# EAGLE design A604X (EAGLE 6.6.0)
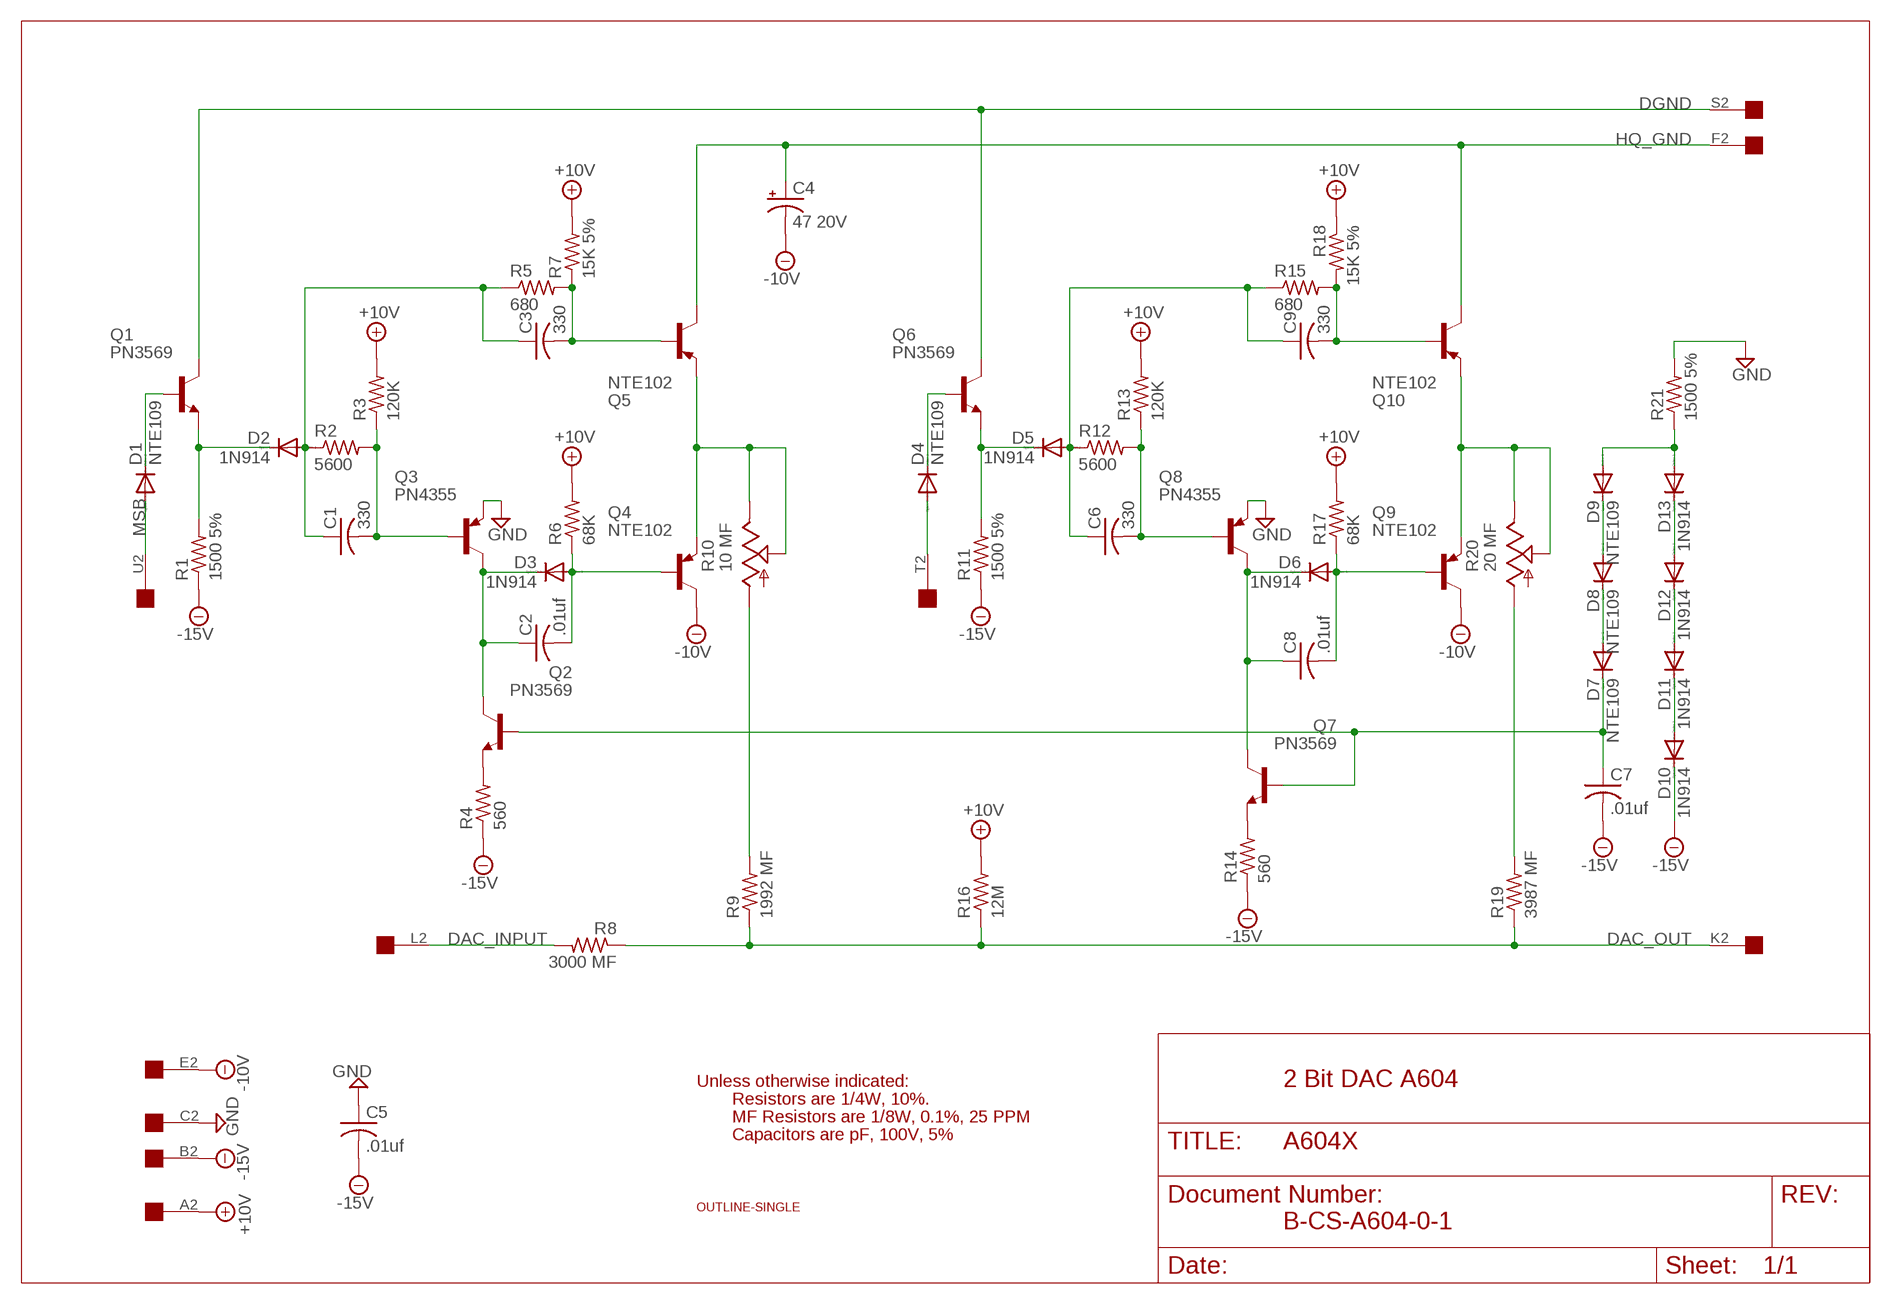
[diagram p0: schematic, sheet 1]

## Parts
C1  330  C-US075-032X103  [C075-032X103]
C2  .01uf  C-US050-025X075  [C050-025X075]
C3  330  C-US075-032X103  [C075-032X103]
C4  47 20V  CPOL-USE22-6AXIAL  [E22-6]
C5  .01uf  C-US050-025X075  [C050-025X075]
C6  330  C-US075-032X103  [C075-032X103]
C7  .01uf  C-US050-025X075  [C050-025X075]
C8  .01uf  C-US050-025X075  [C050-025X075]
C9  330  C-US075-032X103  [C075-032X103]
D1  NTE109  1N4148DO35-10  [DO35-10]
D2  1N914  1N4148DO35-10  [DO35-10]
D3  1N914  1N4148DO35-10  [DO35-10]
D4  NTE109  1N4148DO35-10  [DO35-10]
D5  1N914  1N4148DO35-10  [DO35-10]
D6  1N914  1N4148DO35-10  [DO35-10]
D7  NTE109  1N4148DO35-10  [DO35-10]
D8  NTE109  1N4148DO35-10  [DO35-10]
D9  NTE109  1N4148DO35-10  [DO35-10]
D10  1N914  1N4148DO35-10  [DO35-10]
D11  1N914  1N4148DO35-10  [DO35-10]
D12  1N914  1N4148DO35-10  [DO35-10]
D13  1N914  1N4148DO35-10  [DO35-10]
Q1  PN3569  2N1613-NPN-TO39-EBC  [TO39]
Q2  PN3569  2N1613-NPN-TO39-EBC  [TO39]
Q3  PN4355  2N2904A  [TO39]
Q4  NTE102  2N2904A  [TO39]
Q5  NTE102  2N2904A  [TO39]
Q6  PN3569  2N1613-NPN-TO39-EBC  [TO39]
Q7  PN3569  2N1613-NPN-TO39-EBC  [TO39]
Q8  PN4355  2N2904A  [TO39]
Q9  NTE102  2N2904A  [TO39]
Q10  NTE102  2N2904A  [TO39]
R1  1500 5%  R-US_0207/10  [0207/10]
R2  5600  R-US_0207/10  [0207/10]
R3  120K  R-US_0207/10  [0207/10]
R4  560  R-US_0207/10  [0207/10]
R5  680  R-US_0207/10  [0207/10]
R6  68K  R-US_0207/10  [0207/10]
R7  15K 5%  R-US_0207/10  [0207/10]
R8  3000 MF  R-US_0309/12  [0309/12]
R9  1992 MF  R-US_0309/12  [0309/12]
R10  10 MF  TRIM_US-S75P  [S75P]
R11  1500 5%  R-US_0207/10  [0207/10]
R12  5600  R-US_0207/10  [0207/10]
R13  120K  R-US_0207/10  [0207/10]
R14  560  R-US_0207/10  [0207/10]
R15  680  R-US_0207/10  [0207/10]
R16  12M  R-US_0207/10  [0207/10]
R17  68K  R-US_0207/10  [0207/10]
R18  15K 5%  R-US_0207/10  [0207/10]
R19  3987 MF  R-US_0309/12  [0309/12]
R20  20 MF  TRIM_US-S75P  [S75P]
R21  1500 5%  R-US_0207/10  [0207/10]
U$1  OUTLINE-SINGLE  [SINGLE]
U$3  EDGE-1  [EDGE-CON1]

## Nets
+10V [supply]: R3.2 R6.2 R7.2 R13.2 R16.2 R17.2 R18.1 U$3.A2
-10V [supply]: C4.- Q4.3(C) Q9.3(C) U$3.E2
-15V [supply]: C5.2 C7.2 D10.C R1.1 R4.1 R11.1 R14.1 U$3.B2
DAC_INPUT [supply]: R8.2 U$3.L2
DAC_OUT [supply]: R8.1 R9.1 R16.1 R19.1 U$3.K2
DGND: Q1.3(C) Q6.3(C) U$3.S2
GND [supply]: C5.1 Q3.1(E) Q8.1(E) R21.2 U$3.C2
HQ_GND [supply]: C4.+ Q5.3(C) Q10.3(C) U$3.F2
MSB: D1.A U$3.U2
N$1: D1.C Q1.2(B)
N$2: D2.C Q1.1(E) R1.2
N$3: C1.1 C3.1 D2.A R2.1 R5.1
N$4: C1.2 Q3.2(B) R2.2 R3.1
N$5: C3.2 Q5.2(B) R5.2 R7.1
N$6: C2.1 D3.C Q2.3(C) Q3.3(C)
N$7: C2.2 D3.A Q4.2(B) R6.1
N$8: Q4.1(E) Q5.1(E) R10.E R10.S
N$10: D4.C Q6.2(B)
N$11: D5.C Q6.1(E) R11.2
N$12: C6.1 C9.1 D5.A R12.1 R15.1
N$13: C6.2 Q8.2(B) R12.2 R13.1
N$14: C9.2 Q10.2(B) R15.2 R18.2
N$15: C8.1 D6.C Q7.3(C) Q8.3(C)
N$16: C8.2 D6.A Q9.2(B) R17.1
N$17: Q9.1(E) Q10.1(E) R20.E R20.S
N$18: Q2.1(E) R4.2
N$19: R9.2 R10.A
N$20: R19.2 R20.A
N$21: Q7.1(E) R14.2
N$22: C7.1 D7.C Q2.2(B) Q7.2(B)
N$23: D8.A D9.C
N$24: D7.A D8.C
N$25: D10.A D11.C
N$27: D12.A D13.C
N$28: D11.A D12.C
N$30: D9.A D13.A R21.1
T2: D4.A U$3.T2
Unconnected: U$3.D2 U$3.H2 U$3.J2 U$3.M2 U$3.N2 U$3.P2 U$3.R2 U$3.V2

## Notes on the sheet
- Unless otherwise indicated: | 2 Bit DAC A604
- Resistors are 1/4W, 10%.
- MF Resistors are 1/8W, 0.1%, 25 PPM
- Capacitors are pF, 100V, 5%
- B-CS-A604-0-1

## Library data of the parts
C1-C3 C5-C9 = rcl:C-US: CAPACITOR, American symbol
C4 = rcl:CPOL-US: POLARIZED CAPACITOR, American symbol
D1-D13 = diode:1N4148: DIODE high speed (Philips)
Q1 Q2 Q6 Q7 = transistor:*-NPN-: NPN Transistror BF959 corrected 2008.03.06
Q3-Q5 Q8-Q10 = transistor-pnp:2N2904*: PNP Transistror
R1-R9 R11-R19 R21 = rcl:R-US_: RESISTOR, American symbol
R10 R20 = pot:TRIM_US-: POTENTIOMETER
U$1 = dec-con:OUTLINE-*: Board outlines for DEC boards.
U$3 = dec-con:EDGE-1: Single-Sided DEC Edge Connector -- (side 2)

## Net classes
1 supply: width 0.813 mm

## Board
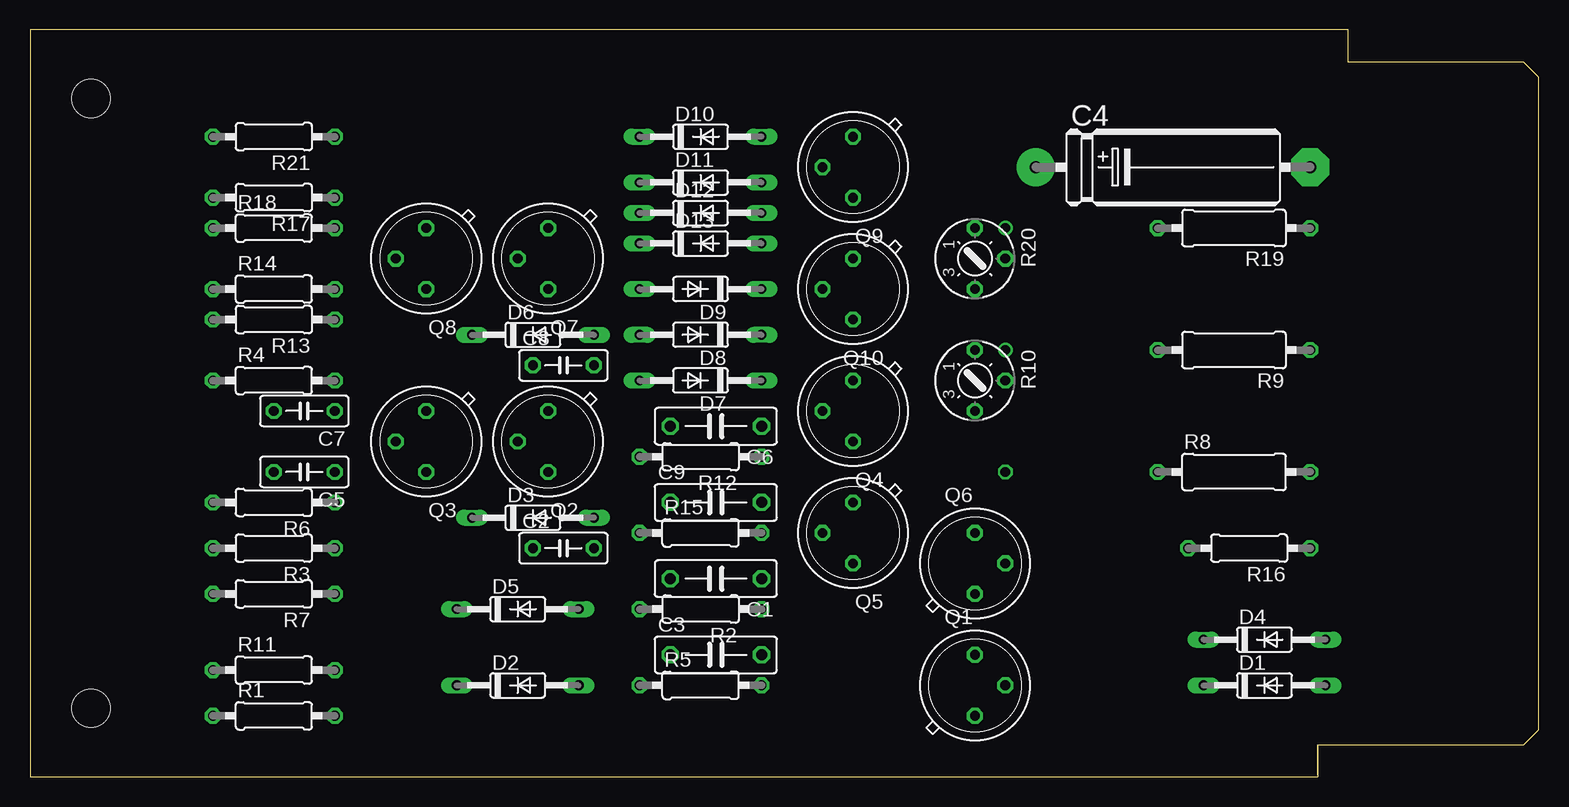
[diagram p1: board, top side]
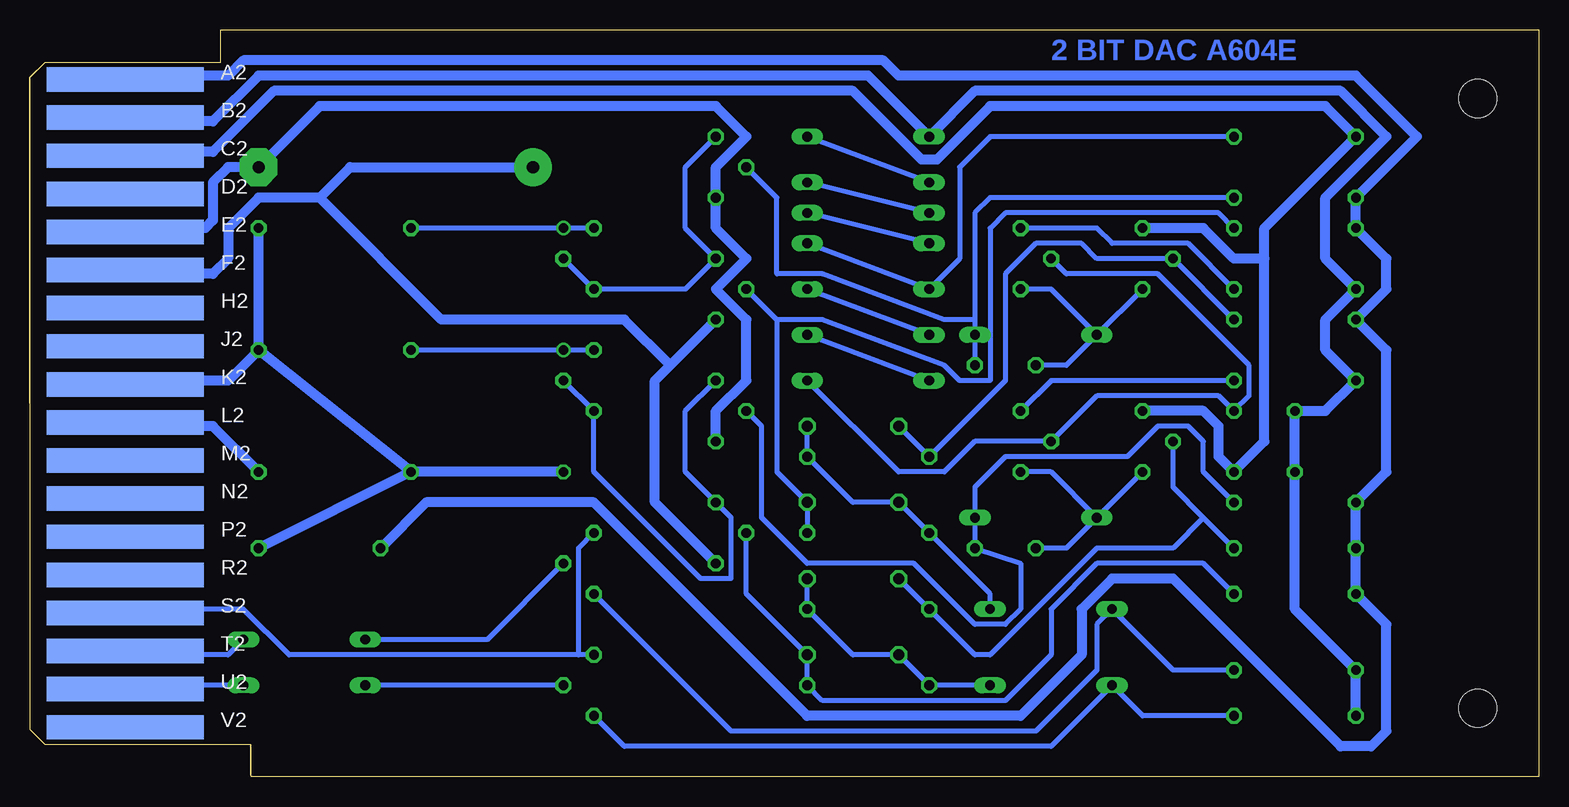
[diagram p2: board, bottom side, seen from below]

Size 125.73 x 62.23 mm. Coordinates in mm from the lower left corner, seen from the top.
Copper layers (1+16): Top 0.035mm / dielectric 1.5mm / Bottom 0.035mm
Design rules "16mils": minimum track width 16mil, minimum drill 32mil, track to track 15mil, track to pad 10mil, pad to pad 10mil, via to via 10mil, smd to smd 10mil, copper to edge 13mil, drill to drill 10mil, minimum pad ring 10mil, minimum via ring 8mil, stop-mask expansion 0mil, vias tented up to drill 0mil, thermal gap 10mil

### Footprints (pad centres in the part's own frame; a part is rotated, then mirrored left to right if it is on the bottom)
C075-032X103 = drill 0.914 octagon: 1 -3.81,0; 2 3.81,0
C050-025X075 = drill 0.813 octagon: 1 -2.54,0; 2 2.54,0
E22-6 = drill 1.016 pad 3.15: + -11.43,0 | drill 1.016 pad 3.15 octagon: - 11.43,0
DO35-10 = drill 0.813 long: A 5.08,0; C -5.08,0
TO39 = drill 0.813 octagon: 1 0,-2.54; 2 2.54,0; 3 0,2.54
0207/10 = drill 0.813 octagon: 1 -5.08,0; 2 5.08,0
0309/12 = drill 0.813 octagon: 1 -6.35,0; 2 6.35,0
S75P = drill 0.813 octagon: A -2.54,0; E 2.54,0; S 0,2.54
SINGLE = hole 3.175: 120.65,56.515; 120.65,5.715
EDGE-CON1 = smd 13.106 x 2.032 bottom: A2 7.938,4.128; B2 7.938,7.303; C2 7.938,10.477; D2 7.938,13.652; E2 7.938,16.828; F2 7.938,20.003; H2 7.938,23.177; J2 7.938,26.352; K2 7.938,29.527; L2 7.938,32.703; M2 7.938,35.877; N2 7.938,39.053; P2 7.938,42.227; R2 7.938,45.403; S2 7.938,48.578; T2 7.938,51.752; U2 7.938,54.928; V2 7.938,58.102

### Placement (x,y rotation side)
C1  57.15,16.51 180 top
C2  44.45,19.05 0 top
C3  57.15,10.16 0 top
C4  95.25,50.8 0 top
C5  22.86,25.4 180 top
C6  57.15,29.21 180 top
C7  22.86,30.48 180 top
C8  44.45,34.29 0 top
C9  57.15,22.86 0 top
D1  102.87,7.62 0 top
D2  40.64,7.62 0 top
D3  41.91,21.59 0 top
D4  102.87,11.43 0 top
D5  40.64,13.97 0 top
D6  41.91,36.83 0 top
D7  55.88,33.02 180 top
D8  55.88,36.83 180 top
D9  55.88,40.64 180 top
D10  55.88,53.34 0 top
D11  55.88,49.53 0 top
D12  55.88,46.99 0 top
D13  55.88,44.45 0 top
Q1  78.74,7.62 0 top
Q2  43.18,27.94 180 top
Q3  33.02,27.94 180 top
Q4  68.58,30.48 180 top
Q5  68.58,20.32 180 top
Q6  78.74,17.78 0 top
Q7  43.18,43.18 180 top
Q8  33.02,43.18 180 top
Q9  68.58,50.8 180 top
Q10  68.58,40.64 180 top
R1  20.32,5.08 0 top
R2  55.88,13.97 180 top
R3  20.32,19.05 180 top
R4  20.32,33.02 0 top
R5  55.88,7.62 0 top
R6  20.32,22.86 180 top
R7  20.32,15.24 180 top
R8  100.33,25.4 0 top
R9  100.33,35.56 180 top
R10  78.74,33.02 270 top
R11  20.32,8.89 0 top
R12  55.88,26.67 180 top
R13  20.32,38.1 180 top
R14  20.32,40.64 0 top
R15  55.88,20.32 0 top
R16  101.6,19.05 180 top
R17  20.32,48.26 180 top
R18  20.32,45.72 0 top
R19  100.33,45.72 180 top
R20  78.74,43.18 270 top
R21  20.32,53.34 180 top
U$1  125.73,62.23 180 top
U$3  125.73,62.23 180 top

### Tracks (layer width: path | path; a pad name or v marks a point on that pad's centre or on a via)
+10V
  Bottom 0.813: U$3.A2 117.22,58.04 116.84,58.42 109.22,58.42 107.95,59.69 54.61,59.69 53.34,58.42 15.24,58.42 10.16,53.34 R17.2 R18.1 12.7,43.18 12.7,40.64 R13.2 12.7,35.56 12.7,25.4 R6.2 R3.2 R7.2 12.7,12.7 12.7,3.81 13.97,2.54 16.51,2.54 30.48,16.51 35.56,16.51 38.1,13.97 38.1,10.16 43.18,5.08 60.96,5.08 78.74,22.86 92.71,22.86 R16.2
-10V
  Bottom 0.813: U$3.E2 117.17,45.39 116.84,45.72 111.12,45.72 110.49,46.35 110.49,49.53 109.22,50.8 C4.- 101.6,55.88 68.58,55.88 66.04,53.34 68.58,50.8 Q9.3 68.58,45.72 66.04,43.18 68.58,40.64 66.04,38.1 66.04,33.02 68.58,30.48 Q4.3
-15V
  Bottom 0.813: R1.1 R11.1 20.32,13.97 C5.2 C7.2 17.78,30.48 R4.1 17.78,35.56 17.78,38.1 R14.1 17.78,43.18 17.78,48.26 12.7,53.34 16.51,57.15 46.99,57.15 D10.C 55.88,58.42 106.68,58.42 110.49,54.61 116.84,54.61 117.13,54.9 U$3.B2
DAC_INPUT
  Bottom 0.813: U$3.L2 117.17,29.54 116.84,29.21 110.49,29.21 R8.2
DAC_OUT  (via drill 0.81)
  Bottom 0.813: U$3.K2 117.14,32.72 116.84,33.02 109.22,33.02 R9.1 | R9.1 R19.1 | R8.1 R16.1 | R8.1 R9.1 | v81.28,25.4 R8.1
DGND
  Bottom 0.406: Q1.3 80.01,10.16 | 80.01,10.16 104.14,10.16 107.95,13.97 115.57,13.97 115.88,13.66 U$3.S2 | Q6.3 80.01,19.05 80.01,10.16
GND
  Bottom 0.813: U$3.C2 117.17,51.74 116.84,52.07 110.49,52.07 105.41,57.15 57.15,57.15 51.44,51.44 50.16,51.44 45.72,55.88 17.78,55.88 R21.2 22.86,45.72 22.86,43.18 | 22.86,43.18 22.86,27.94 C5.1 26.67,26.67 26.67,29.21 27.94,30.48 Q3.1 | Q8.1 27.94,45.72 25.4,43.18 22.86,43.18
HQ_GND
  Bottom 0.813: Q5.3 73.66,22.86 73.66,33.02 72.39,34.29 | 72.39,34.29 Q10.3 | U$3.F2 117.12,42.19 116.84,41.91 110.49,41.91 109.22,43.18 109.22,45.72 106.68,48.26 101.6,48.26 | C4.+ 99.06,50.8 101.6,48.26 | 72.39,34.29 76.2,38.1 91.44,38.1 101.6,48.26
MSB
  Bottom 0.406: U$3.U2 117.2,7.26 116.84,7.62 D1.A
N$1
  Bottom 0.406: Q1.2 D1.C
N$2
  Bottom 0.406: R1.2 33.02,5.08 D2.C 40.64,2.54 76.2,2.54 Q1.1
N$3
  Bottom 0.406: D2.A R5.1 C3.1 57.15,10.16 R2.1 C1.1
N$4
  Bottom 0.406: R3.1 27.94,21.59 | 27.94,21.59 30.48,24.13 Q3.2 | C1.2 R2.2 46.99,10.16 45.72,10.16 36.83,19.05 30.48,19.05 27.94,21.59
N$5
  Bottom 0.406: R7.1 27.94,17.78 36.83,17.78 40.64,13.97 40.64,10.16 44.45,6.35 59.69,6.35 R5.2 C3.2 66.04,15.24 Q5.2
N$6
  Bottom 0.406: C2.1 39.37,19.05 D3.C | Q2.3 40.64,25.4 D3.C | D3.C Q3.3
N$7
  Bottom 0.406: R6.1 27.94,25.4 27.94,27.94 29.21,29.21 31.75,29.21 34.29,26.67 44.45,26.67 46.99,24.13 D3.A C2.2 43.18,17.78 43.18,13.97 44.45,12.7 46.99,12.7 52.07,17.78 60.96,17.78 64.77,21.59 64.77,29.21 Q4.2
N$8
  Bottom 0.406: Q4.1 71.12,30.48 71.12,25.4 Q5.1 67.31,21.59 67.31,16.51 69.85,16.51 78.74,25.4 R10.E R10.S
N$10
  Bottom 0.406: D4.C 87.63,11.43 Q6.2
N$11
  Bottom 0.406: R11.2 30.48,8.89 D5.C 36.83,12.7 36.83,8.89 41.91,3.81 67.31,3.81 Q6.1
N$12
  Bottom 0.406: D5.A 45.72,15.24 R15.1 C9.1 57.15,22.86 R12.1 C6.1
N$13
  Bottom 0.406: C6.2 R12.2 44.45,33.02 44.45,41.91 41.91,44.45 38.1,44.45 36.83,43.18 Q8.2 R13.1
N$14
  Bottom 0.406: R15.2 C9.2 63.5,25.4 63.5,38.1 | 63.5,38.1 Q10.2 | R18.2 26.67,46.99 44.45,46.99 45.72,45.72 45.72,33.02 48.26,33.02 49.53,34.29 59.69,38.1 63.5,38.1
N$15
  Bottom 0.406: C8.1 39.37,34.29 D6.C | D6.C Q8.3 | Q7.3 40.64,40.64 D6.C
N$16
  Bottom 0.406: C8.2 D6.A 46.99,38.1 | R17.1 45.72,48.26 46.99,46.99 46.99,38.1 | Q9.2 63.5,48.26 63.5,41.91 59.69,41.91 49.53,38.1 46.99,38.1
N$17
  Bottom 0.406: Q9.1 71.12,50.8 71.12,45.72 Q10.1 71.12,40.64 R20.E R20.S
N$18
  Bottom 0.406: R4.2 40.64,33.02 Q2.1
N$19  (via drill 0.81)
  Bottom 0.406: R10.A v81.28,35.56 R9.2
N$20  (via drill 0.81)
  Bottom 0.406: R20.A v81.28,45.72 R19.2
N$21
  Bottom 0.406: R14.2 29.21,44.45 35.56,44.45 36.83,45.72 Q7.1
N$22
  Bottom 0.406: D7.C 53.34,25.4 49.53,25.4 46.99,27.94 Q2.2 36.83,31.75 26.67,31.75 C7.1 24.13,31.75 24.13,34.29 31.75,41.91 39.37,41.91 Q7.2
N$23
  Bottom 0.406: D8.A D9.C
N$24
  Bottom 0.406: D7.A D8.C
N$25
  Bottom 0.406: D11.C D10.A
N$27
  Bottom 0.406: D13.C D12.A
N$28
  Bottom 0.406: D12.C D11.A
N$30
  Bottom 0.406: D13.A D9.A 48.26,43.18 48.26,50.8 45.72,53.34 R21.1
T2
  Bottom 0.406: U$3.T2 117.17,10.49 116.84,10.16 109.22,10.16 D4.A

### Text on the board
Bottom: 2 BIT DAC A604E